# Altium schematic sheet device-lvbms.SchDoc
size 297 x 209 mm
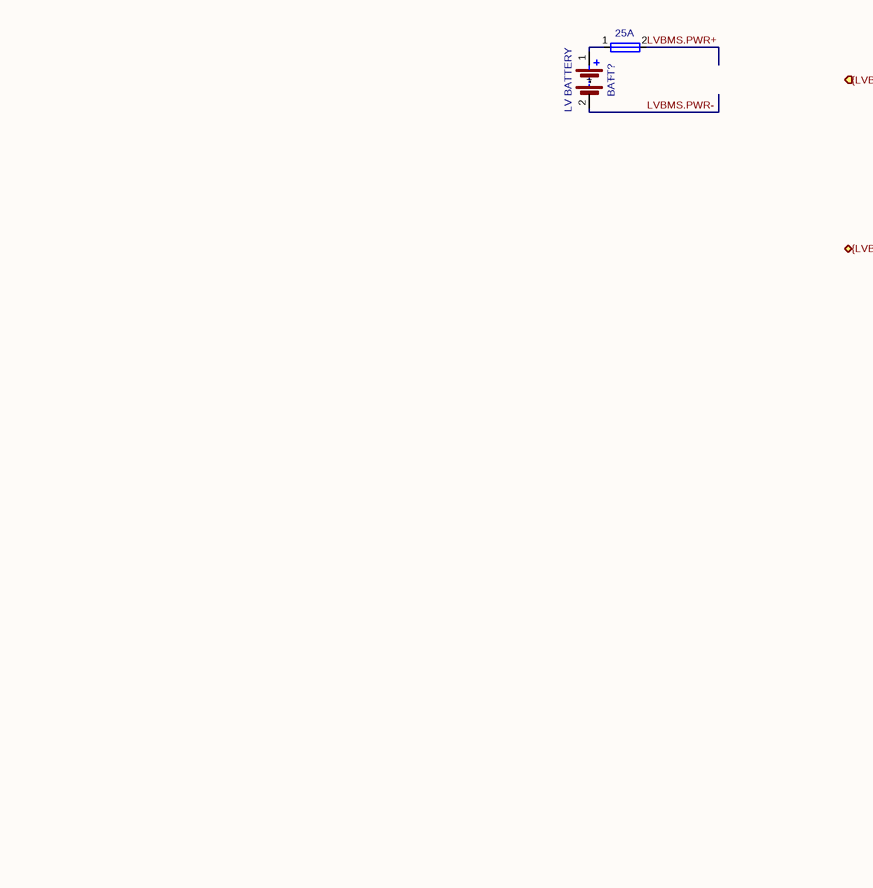
[diagram p0: device-lvbms.SchDoc]

## Parts
BATT?  Conn Name: LV BATTERY  (hidden comment: ~)
F?  25A

## Ports
{LVBMS.DATA} (bidir), {LVBMS.PWR} (in)

## Nets
LVBMS.PWR+: F?.2
LVBMS.PWR-: BATT?.2(-)
NetBATT?_1: BATT?.1(+) F?.1

## Notes on the sheet
- 1
- 2
- 3
- 4
- 5
- 6
- A
- B
- C
- D
- Title:
- File: device-lvbms.kicad_sch
- Sheet: /
- KiCad E.D.A.  kicad (5.1.4)-1
- Size: A4
- Date:
- Rev:
- Id: 1/1

## Library data of the parts
BATT? = Battery: Value: ~
F? = Fuse: Value: 25A